# EAGLE schematic untitled (EAGLE 6.2)
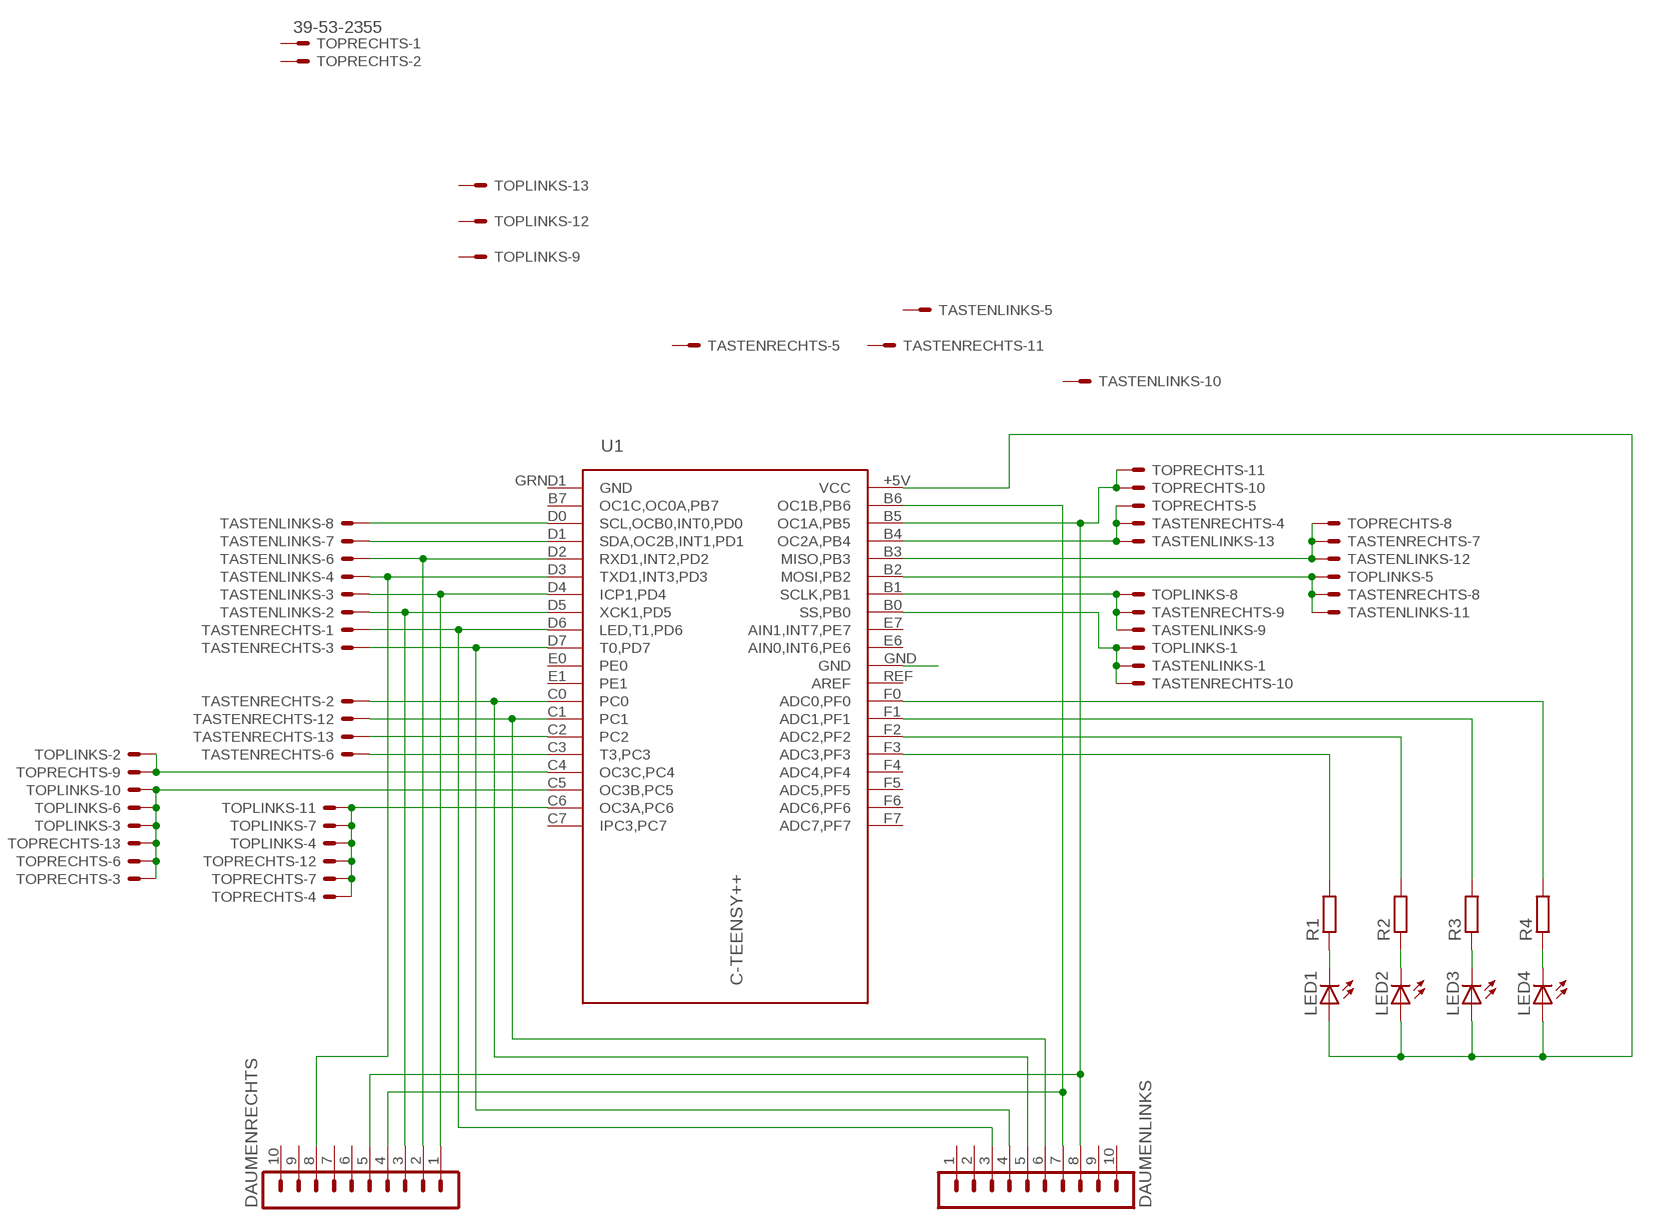
[diagram p0: schematic, sheet 1]

## Parts
DAUMENLINKS  MA10-1  [MA10-1]
DAUMENRECHTS  MA10-1  [MA10-1]
LED1  LED3MM  [LED3MM]
LED2  LED3MM  [LED3MM]
LED3  LED3MM  [LED3MM]
LED4  LED3MM  [LED3MM]
R1  R-EU_R1206  [R1206]
R2  R-EU_R1206  [R1206]
R3  R-EU_R1206  [R1206]
R4  R-EU_R1206  [R1206]
TASTENLINKS  39-53-2355  [39-53-2135]
TASTENRECHTS  39-53-2355  [39-53-2135]
TOPLINKS  39-53-2355  [39-53-2135]
TOPRECHTS  39-53-2355  [39-53-2135]
U1  C-TEENSY++  [TEENSY++]

## Nets
B0: TASTENLINKS.P$1 TASTENRECHTS.P$10 TOPLINKS.P$1 U1.B0(SS,PB0)
B1: TASTENLINKS.P$9 TASTENRECHTS.P$9 TOPLINKS.P$8 U1.B1(SCLK,PB1)
B2: TASTENLINKS.P$11 TASTENRECHTS.P$8 TOPLINKS.P$5 U1.B2(MOSI,PB2)
B3: TASTENLINKS.P$12 TASTENRECHTS.P$7 TOPRECHTS.P$8 U1.B3(MISO,PB3)
B4: TASTENLINKS.P$13 TASTENRECHTS.P$4 TOPRECHTS.P$5 U1.B4(OC2A,PB4)
B5: DAUMENLINKS.8 DAUMENRECHTS.5 TOPRECHTS.P$10 TOPRECHTS.P$11 U1.B5(OC1A,PB5)
B6: DAUMENLINKS.7 DAUMENRECHTS.4 U1.B6(OC1B,PB6)
C0: DAUMENLINKS.5 TASTENRECHTS.P$2 U1.C0
C1: DAUMENLINKS.6 TASTENRECHTS.P$12 U1.C1
C2: TASTENRECHTS.P$13 U1.C2
C3: TASTENRECHTS.P$6 U1.C3(T3,PC3)
C4: TOPLINKS.P$2 TOPRECHTS.P$9 U1.C4(OC3C,PC4)
C5: TOPLINKS.P$3 TOPLINKS.P$6 TOPLINKS.P$10 TOPRECHTS.P$3 TOPRECHTS.P$6 TOPRECHTS.P$13 U1.C5(OC3B,PC5)
C6: TOPLINKS.P$4 TOPLINKS.P$7 TOPLINKS.P$11 TOPRECHTS.P$4 TOPRECHTS.P$7 TOPRECHTS.P$12 U1.C6(OC3A,PC6)
D0: TASTENLINKS.P$8 U1.D0(SCL,OCB0,INT0,PD0)
D1: TASTENLINKS.P$7 U1.D1(SDA,OC2B,INT1,PD1)
D2: DAUMENRECHTS.2 TASTENLINKS.P$6 U1.D2(RXD1,INT2,PD2)
D3: DAUMENRECHTS.8 TASTENLINKS.P$4 U1.D3(TXD1,INT3,PD3)
D4: DAUMENRECHTS.1 TASTENLINKS.P$3 U1.D4(ICP1,PD4)
D5: DAUMENRECHTS.3 TASTENLINKS.P$2 U1.D5(XCK1,PD5)
D6: DAUMENLINKS.3 TASTENRECHTS.P$1 U1.D6(LED,T1,PD6)
D7: DAUMENLINKS.4 TASTENRECHTS.P$3 U1.D7(T0,PD7)
N$1: U1.GND
N$7: R1.2 U1.F3(ADC3,PF3)
N$8: R2.2 U1.F2(ADC2,PF2)
N$9: R3.2 U1.F1(ADC1,PF1)
N$10: R4.2 U1.F0(ADC0,PF0)
N$11: LED1.A LED2.A LED3.A LED4.A U1.+5V(VCC)
N$14: LED4.K(C) R4.1
N$15: LED3.K(C) R3.1
N$16: LED2.K(C) R2.1
N$17: LED1.K(C) R1.1
Unconnected: DAUMENLINKS.1 DAUMENLINKS.2 DAUMENLINKS.9 DAUMENLINKS.10 DAUMENRECHTS.6 DAUMENRECHTS.7 DAUMENRECHTS.9 DAUMENRECHTS.10 TASTENLINKS.P$5 TASTENLINKS.P$10 TASTENRECHTS.P$5 TASTENRECHTS.P$11 TOPLINKS.P$9 TOPLINKS.P$12 TOPLINKS.P$13 TOPRECHTS.P$1 TOPRECHTS.P$2 U1.B7(OC1C,OC0A,PB7) U1.C7(IPC3,PC7) U1.E0 U1.E1 U1.E6(AIN0,INT6,PE6) U1.E7(AIN1,INT7,PE7) U1.F4(ADC4,PF4) U1.F5(ADC5,PF5) U1.F6(ADC6,PF6) U1.F7(ADC7,PF7) U1.REF(AREF)

## Power pins joined to a net without a drawn wire
GND: U1.GRND1(GND)

## Library data of the parts
DAUMENLINKS DAUMENRECHTS = con-lstb:MA10-1: PIN HEADER; OC_FARNELL: unknown; OC_NEWARK: unknown
LED1-LED4 = led:LED: LED OSRAM: - CHIPLED LG R971, LG N971, LY N971, LG Q971, LY Q971, LO R971, LY R971 LH N974, LH R974 LS Q976, LO Q976, LY Q976 LO Q996 - Hyper CHIPLED LW Q18S LB Q993, LB Q99A, LB R99A - SideLED LS A670, LO A670, LY A670, LG A670, LP A670 LB A673, LV A673, LT A673, LW A673 LH A674 LY A675 LS A676, LA A676, LO A676, LY A676, LW A676 LS A679, LY A679, LG A679 - Hyper Micro SIDELED® LS Y876, LA Y876, LO Y876, LY Y876 LT Y87S - SmartLED LW L88C, LW L88S LB L89C, LB L89S, LG L890 LS L89K, LO L89K, LY L89K LS L896, LA L896, LO L896, LY L896 - TOPLED LS T670, LO T670, LY T670, LG T670, LP T670 LSG T670, LSP T670, LSY T670, LOP T670, LYG T670 LG T671, LOG T671, LSG T671 LB T673, LV T673, LT T673, LW T673 LH T674 LS T676, LA T676, LO T676, LY T676, LB T676, LH T676, LSB T676, LW T676 LB T67C, LV T67C, LT T67C, LS T67K, LO T67K, LY T67K, LW E67C LS E67B, LA E67B, LO E67B, LY E67B, LB E67C, LV E67C, LT E67C LW T67C LS T679, LY T679, LG T679 LS T770, LO T770, LY T770, LG T770, LP T770 LB T773, LV T773, LT T773, LW T773 LH T774 LS E675, LA E675, LY E675, LS T675 LS T776, LA T776, LO T776, LY T776, LB T776 LHGB T686 LT T68C, LB T68C - Hyper Mini TOPLED® LB M676 - Mini TOPLED Santana® LG M470 LS M47K, LO M47K, LY M47K Source: http://www.osram.convergy.de/
R1-R4 = rcl:R-EU_: RESISTOR, European symbol
TASTENLINKS TASTENRECHTS TOPLINKS TOPRECHTS = con-molex-39-53:39-53-2355
U1 = teensypp:C-TEENSY++